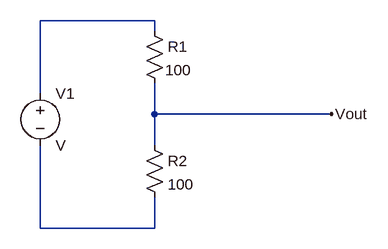
[diagram p0: schematic Potential Divider.asc]
Potential Divider.asc, the LTspice schematic file:
Version 4
SHEET 1 880 680
WIRE 240 -64 64 -64
WIRE 240 -48 240 -64
WIRE 64 48 64 -64
WIRE 240 80 240 32
WIRE 512 80 240 80
WIRE 240 128 240 80
WIRE 64 256 64 128
WIRE 240 256 240 208
WIRE 240 256 64 256
FLAG 512 80 Vout
SYMBOL res 224 -64 R0
WINDOW 3 32 76 Left 2
SYMATTR InstName R1
SYMATTR Value 100
SYMBOL res 224 112 R0
SYMATTR InstName R2
SYMATTR Value 100
SYMBOL voltage 64 32 R0
SYMATTR InstName V1

The netlist it stands for:
* Potential Divider.asc
R1 N001 Vout 100
R2 Vout N002 100
V1 N001 N002 V
.backanno
.end